# Altium schematic sheet 2_Microcontroller.SchDoc
size A4; SheetNumber: 2; SheetTotal: 4
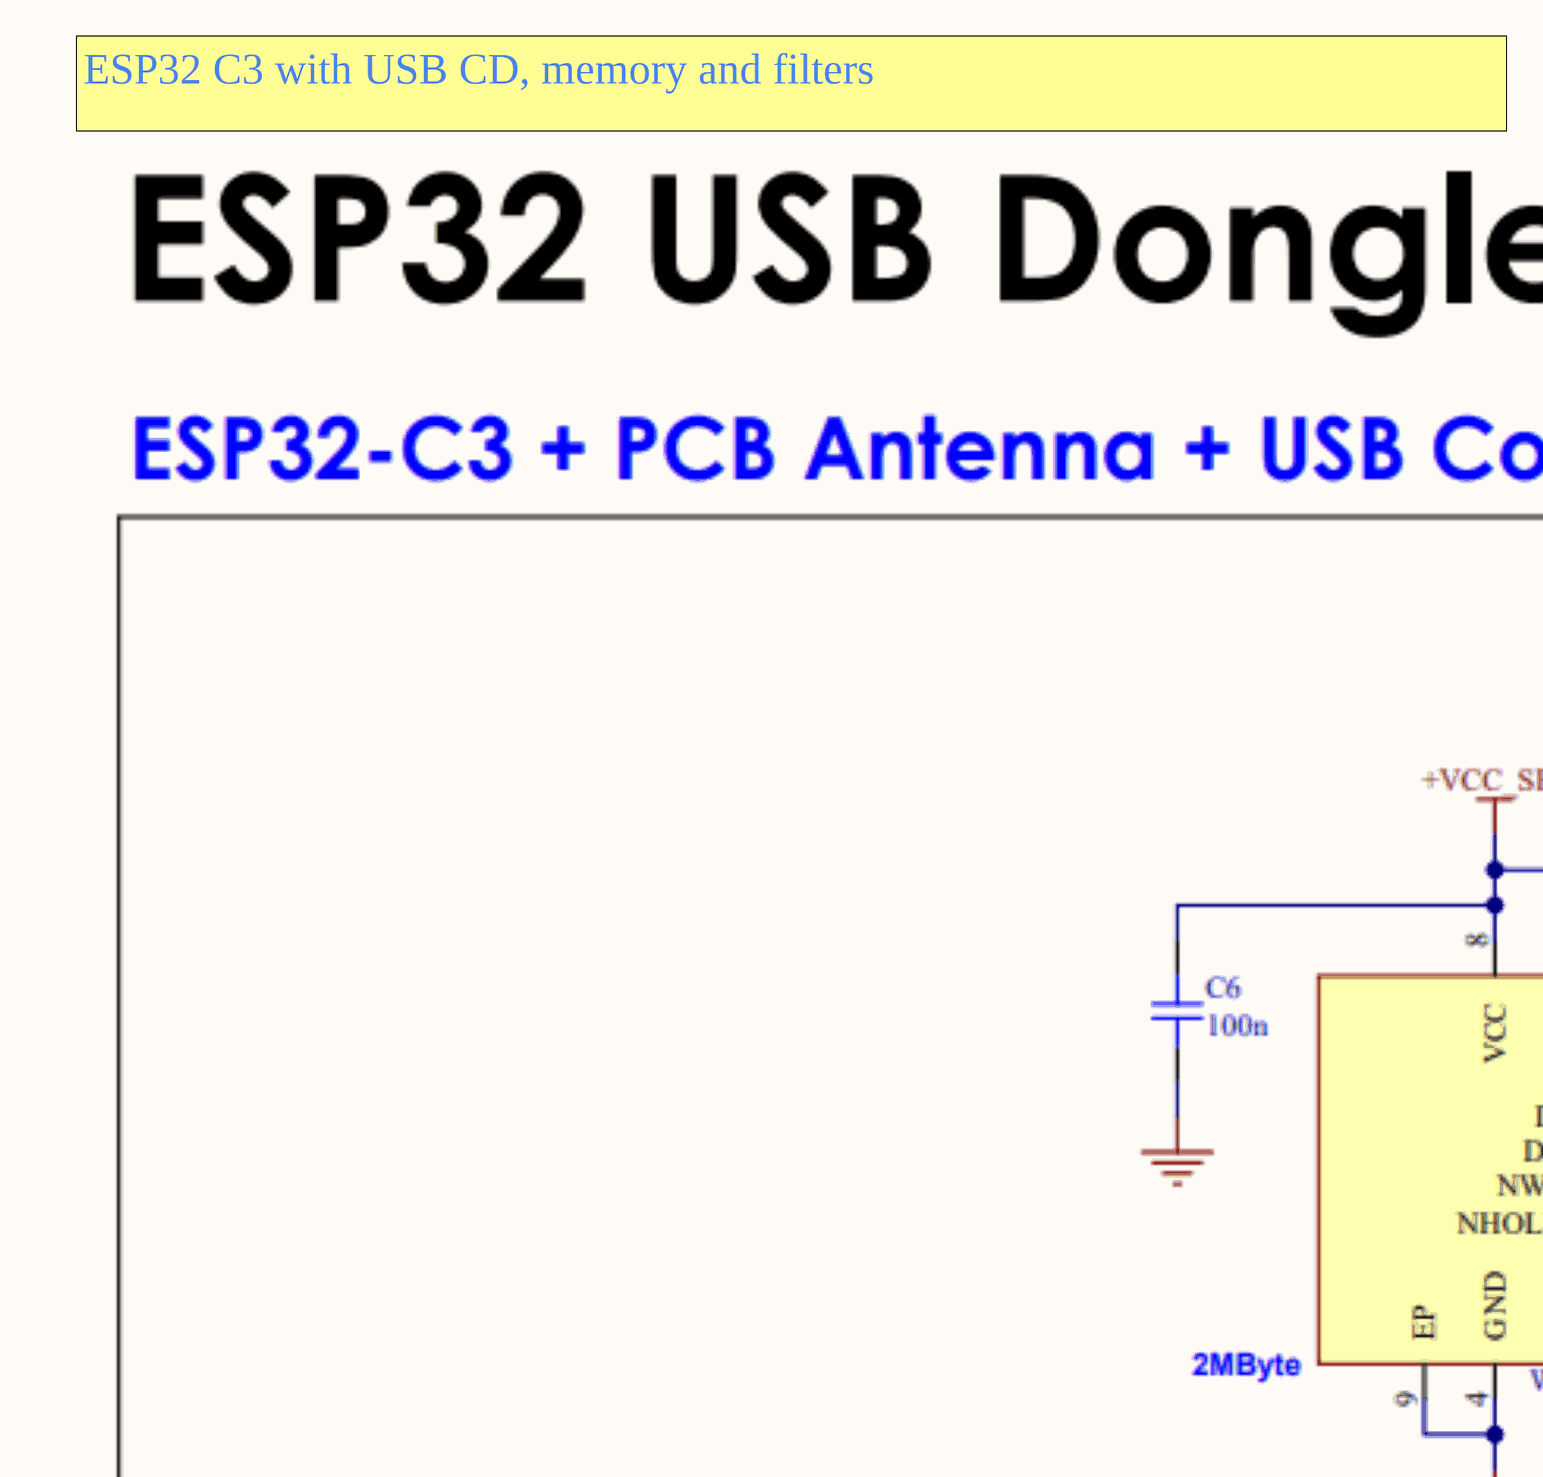
[diagram p0: 2_Microcontroller.SchDoc, top right]
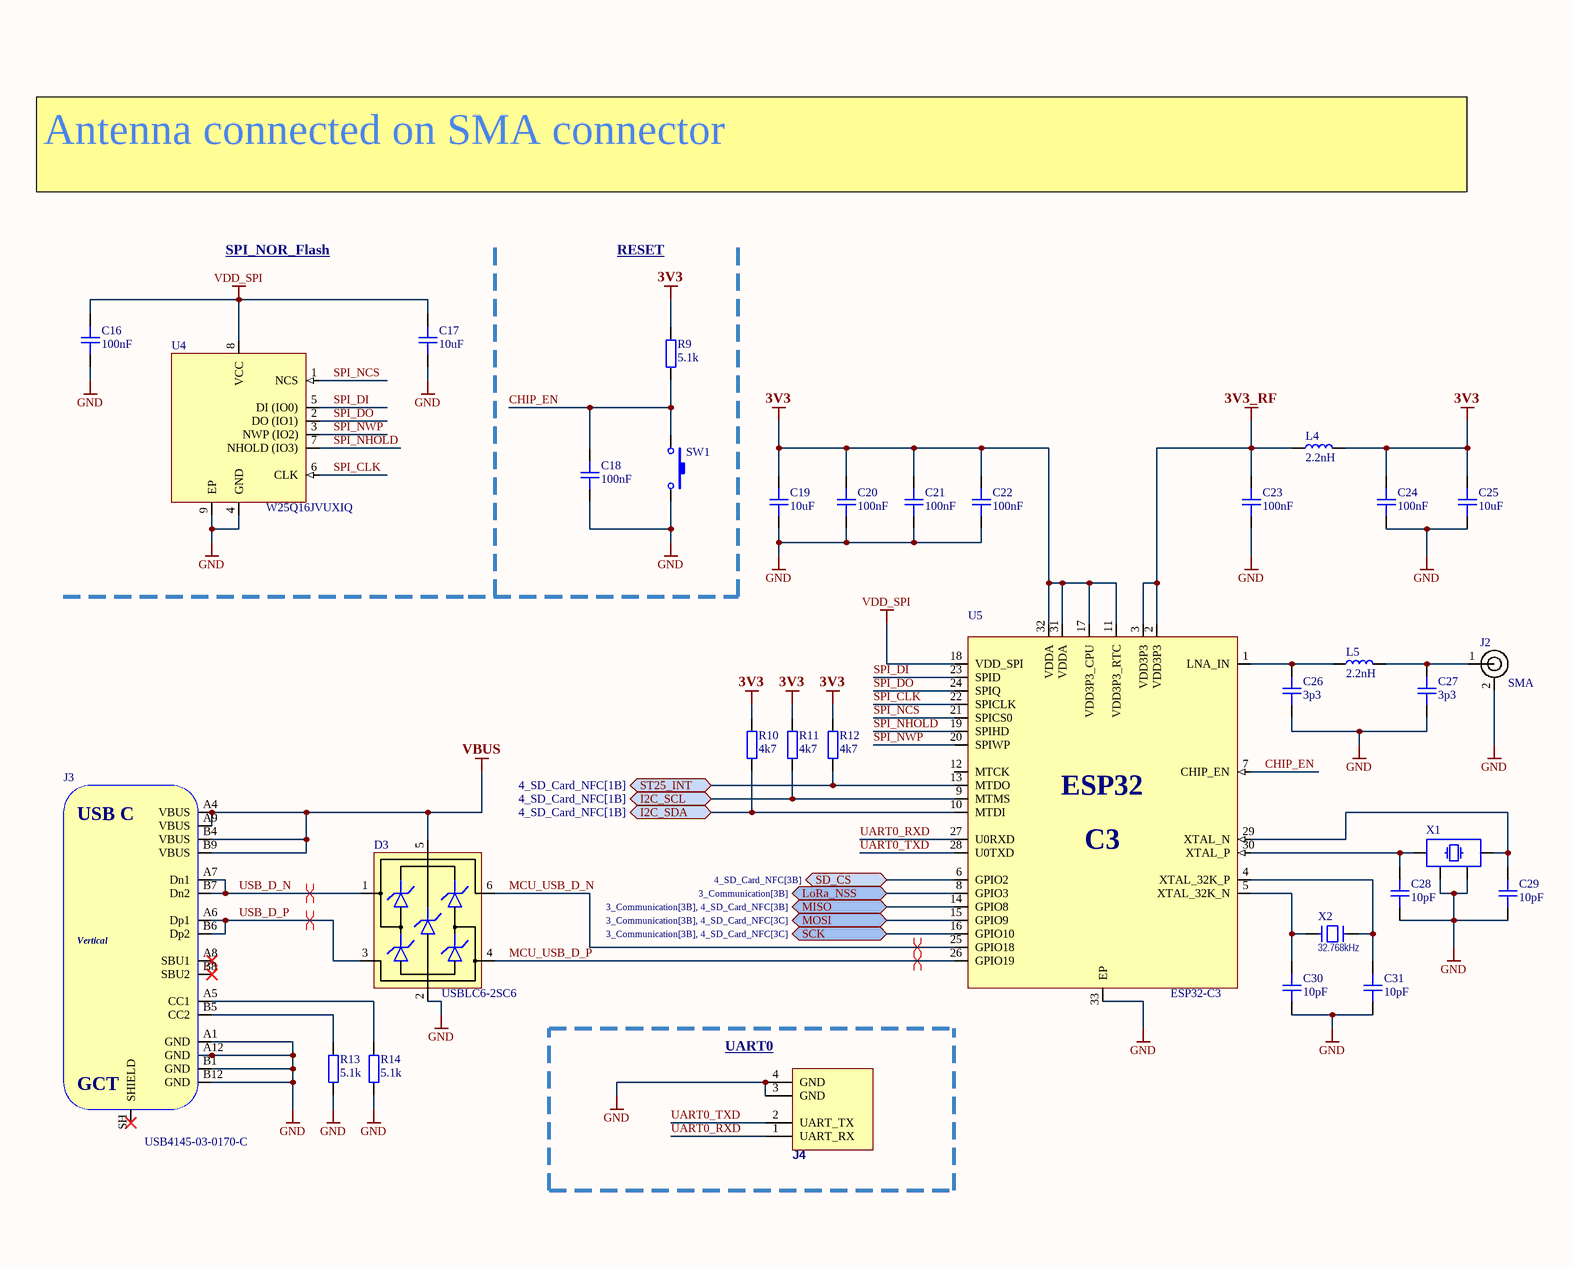
[diagram p1: 2_Microcontroller.SchDoc, bottom left]
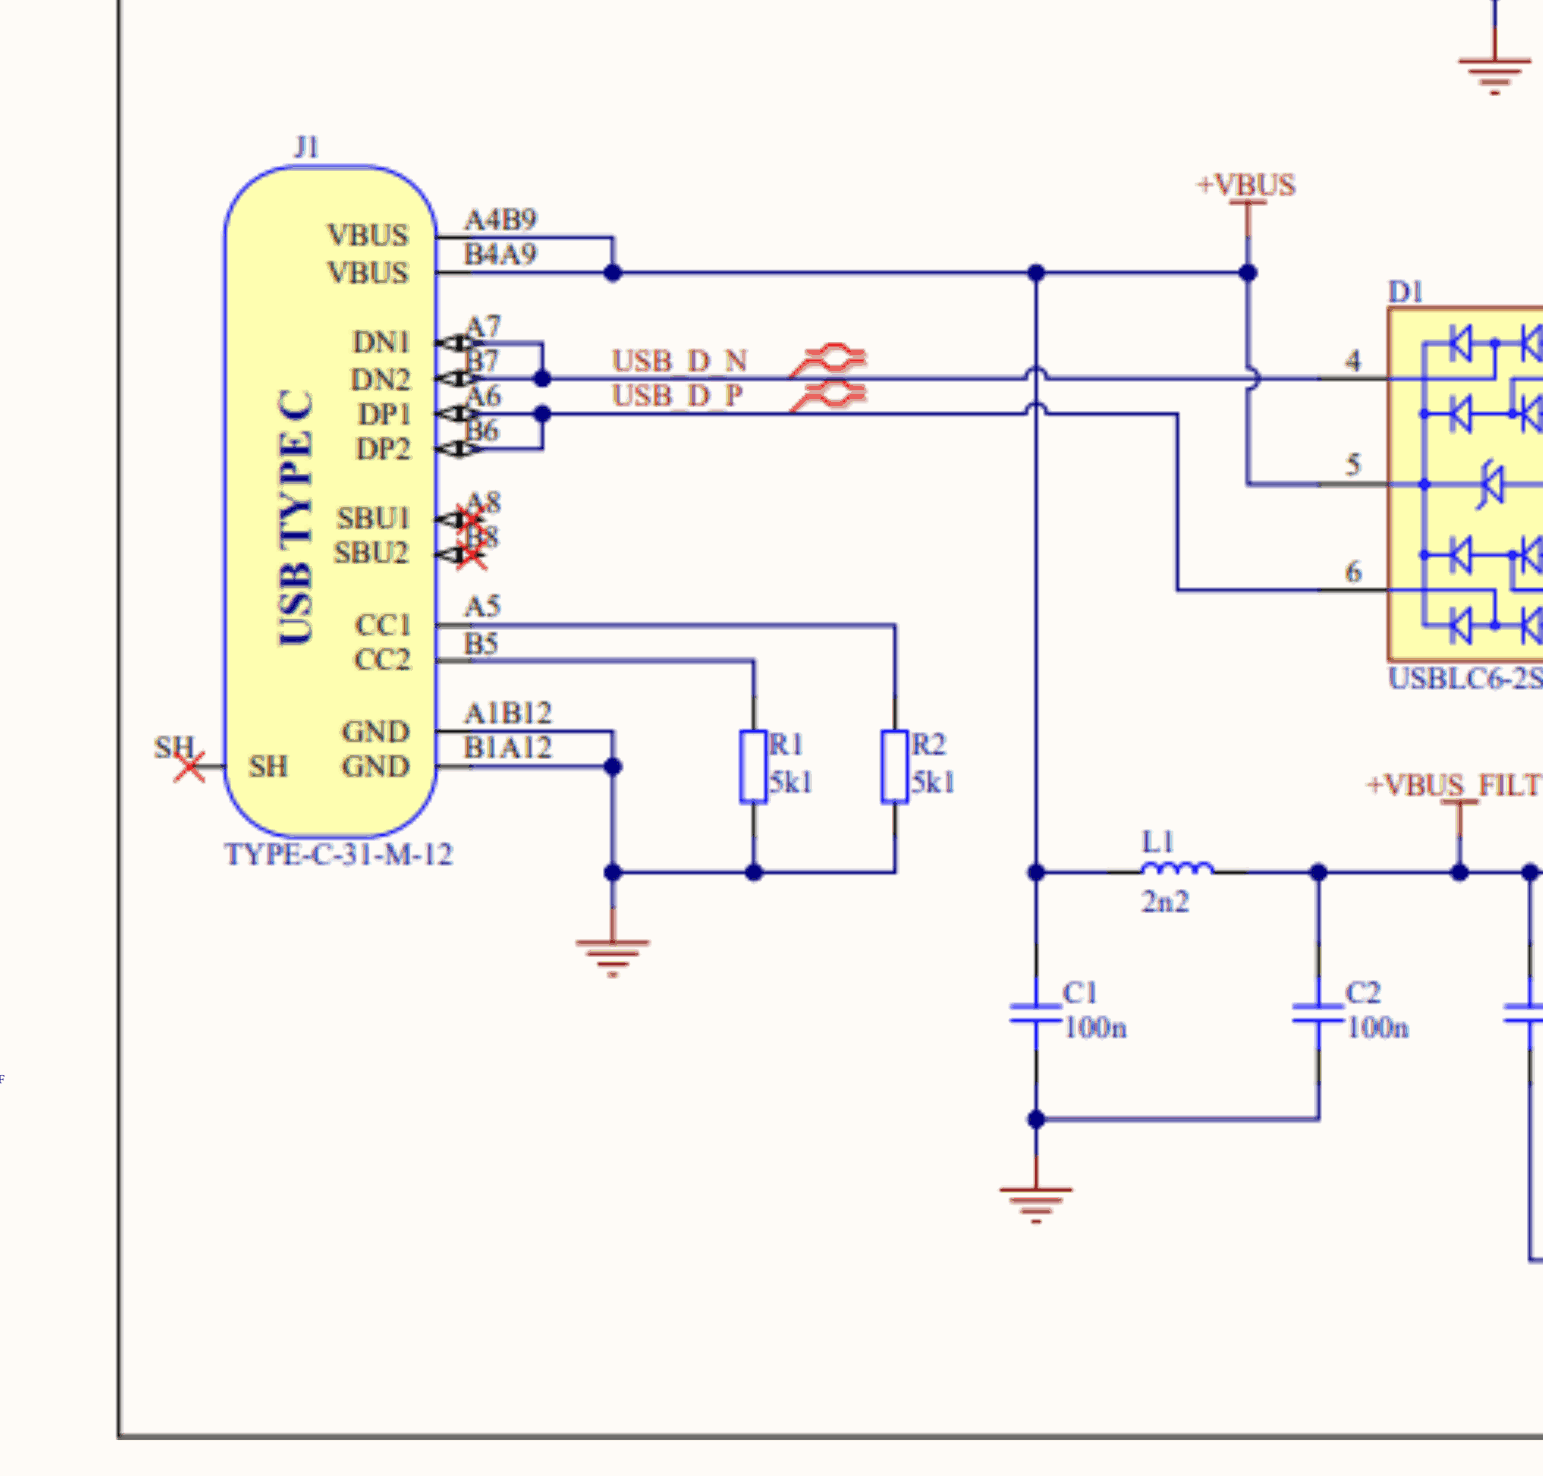
[diagram p2: 2_Microcontroller.SchDoc, bottom right]

## Parts
C16  100nF  [CAP_0603]
C17  10uF  [CAP_0805]
C18  100nF  [CAP_0603]
C19  10uF  [CAP_0805]
C20  100nF  [CAP_0603]
C21  100nF  [CAP_0603]
C22  100nF  [CAP_0603]
C23  100nF  [CAP_0603]
C24  100nF  [CAP_0603]
C25  10uF  [CAP_0805]
C26  3p3  [CAP_0603]
C27  3p3  [CAP_0603]
C28  10pF  [CAP_0603]
C29  10pF  [CAP_0603]
C30  10pF  [CAP_0603]
C31  10pF  [CAP_0603]
D3  USBLC6-2SC6  [SOT-23-6]
J2  SMA  [CON-SMA-EDGE-S]
J3  USB4145-03-0170-C  [USB4145-03-0170-C]
J4  Header1x4  (value not drawn)
L4  2.2nH  [IND_1008]
L5  2.2nH  [IND_1008]
R9  5.1k  [RES_0603]
R10  4k7  [RES_0603]
R11  4k7  [RES_0603]
R12  4k7  [RES_0603]
R13  5.1k  [RES_0603]
R14  5.1k  [RES_0603]
SW1  PTS645SM43SMTR92 LFS  [SW_PB]  (value not drawn)
U4  W25Q16JVUXIQ  [USON-8-2X3MM]
U5  ESP32-C3  [QFN32-5x5]
X1  XTAL_2016  [XTAL_2016]  (value not drawn)
X2  32.768kHz  [SX-3215]

## Blocks framed on the sheet
UART0: J4

## Ports
I2C_SCL (bidir, see 4_SD_Card_NFC[1B]), I2C_SDA (bidir, see 4_SD_Card_NFC[1B]), LoRa_NSS (bidir, see 3_Communication[3B]), MISO (bidir, see 3_Communication[3B], 4_SD_Card_NFC[3B]), MOSI (bidir, see 3_Communication[3B], 4_SD_Card_NFC[3C]), SCK (bidir, see 3_Communication[3B], 4_SD_Card_NFC[3C]), SD_CS (bidir, see 4_SD_Card_NFC[3B]), ST25_INT (bidir, see 4_SD_Card_NFC[1B])

## Nets
3V3: C19.2 C20.2 C21.2 C22.2 C24.2 C25.2 L4.2 R9.2 R10.1 R11.1 R12.1 U5.11(VDD3P3_RTC) U5.17(VDD3P3_CPU) U5.31(VDDA) U5.32(VDDA)
3V3_RF: C23.2 L4.1 U5.2(VDD3P3) U5.3(VDD3P3)
GND: C16.1 C17.1 C18.1 C19.1 C20.1 C21.1 C22.1 C23.1 C24.1 C25.1 C26.1 C27.1 C28.1 C29.1 C30.1 C31.1 D3.2(GND) J2.2 J3.A1(GND) J3.A12(GND) J3.B1(GND) J3.B12(GND) J4.3(GND) J4.4(GND) R13.1 R14.1 SW1.2 U4.4(GND) U4.9(EP) U5.33(EP) X1.2 X1.4
VBUS: D3.5(VBUS) J3.A4(VBUS) J3.A9(VBUS) J3.B4(VBUS) J3.B9(VBUS)
VDD_SPI: C16.2 C17.2 U4.8(VCC) U5.18(VDD_SPI)
CHIP_EN: C18.2 R9.1 SW1.1 U5.7(CHIP_EN)
I2C_SCL: R11.2 U5.9(MTMS) ; port I2C_SCL
I2C_SDA: R10.2 U5.10(MTDI) ; port I2C_SDA
LoRa_NSS: U5.8(GPIO3) ; port LoRa_NSS
MCU_USB_D_N: D3.6(IO1) U5.25(GPIO18)
MCU_USB_D_P: D3.4(IO2) U5.26(GPIO19)
MISO: U5.14(GPIO8) ; port MISO
MOSI: U5.15(GPIO9) ; port MOSI
SCK: U5.16(GPIO10) ; port SCK
SD_CS: U5.6(GPIO2) ; port SD_CS
SPI_CLK: U4.6(CLK) U5.22(SPICLK)
SPI_DI: U4.5(DI_(IO0)) U5.23(SPID)
SPI_DO: U4.2(DO_(IO1)) U5.24(SPIQ)
SPI_NCS: U4.1(NCS) U5.21(SPICS0)
SPI_NHOLD: U4.7(NHOLD_(IO3)) U5.19(SPIHD)
SPI_NWP: U4.3(NWP_(IO2)) U5.20(SPIWP)
ST25_INT: R12.2 U5.13(MTDO) ; port ST25_INT
UART0_RXD: J4.1(UART_RX) U5.27(U0RXD)
UART0_TXD: J4.2(UART_TX) U5.28(U0TXD)
USB_D_N: D3.1(IO1) J3.A7(Dn1) J3.B7(Dn2)
USB_D_P: D3.3(IO2) J3.A6(Dp1) J3.B6(Dp2)
NetC26_2: C26.2 L5.1 U5.1(LNA_IN)
NetC27_2: C27.2 J2.1 L5.2
NetC28_2: C28.2 U5.30(XTAL_P) X1.1
NetC29_2: C29.2 U5.29(XTAL_N) X1.3
NetC30_2: C30.2 U5.5(XTAL_32K_N) X2.2
NetC31_2: C31.2 U5.4(XTAL_32K_P) X2.1
NetJ3_A5: J3.A5(CC1) R14.2
NetJ3_B5: J3.B5(CC2) R13.2

Not connected (* = marked no-connect by the designer): J3 A8(SBU1)* B8(SBU2)* SH(SHIELD)*; U5 12(MTCK)

## Layout directives
differential pair: MCU_USB_D_N, MCU_USB_D_P, USB_D_N, USB_D_P

## Notes on the sheet
- ESP32 C3 with USB CD, memory and filters
- Antenna connected on SMA connector
- SPI_NOR_Flash
- RESET
- (in symbol ESP32-C3) ESP32; C3
- (in symbol USB4145-03-0170-C) USB C; Vertical

## Library data of the parts
C16 C18 C20-C24 C26-C31 = CAP_0603: Capacitor SMD 0603; Manufacturer: *; Manufacturer Part Number: *; Distributor Link: *; LCSC: *; Rating: *; Dielectric: *
C17 C19 C25 = CAP_0805: Capacitor SMD 0805; Manufacturer: *; Manufacturer Part Number: *; Distributor Link: *; LCSC: *; Rating: *; Dielectric: *
D3 = USBLC6-2SC6: Low-Capacitance ESD Protection USB; Manufacturer: STMicroelectronics; Manufacturer Part Number: USBLC6-2SC6; Distributor Link: https://www.mouser.de/ProductDetail/STMicroelectronics/USBLC6-2SC6?qs=po45yt2pPpu%2FhNIlwQdTlg%3D%3D
J2 = CON-SMA-EDGE-S: RF Connector SMA Female 50 Ohms 18 GHz PCB Edge Mount; Manufacturer: RF Solutions; Manufacturer Part Number: CON-SMA-EDGE-S
J3 = USB4145-03-0170-C: USB Connector Type C SMT 16 Pin Vertical; Manufacturer: GCT; Manufacturer Part Number: USB4145-03-0170-C
J4 = Header1x4: *; PackageReference: *; Manufacturer Part Number 1: *
L4 L5 = IND_1008: Inductor SMD 1008
R9-R14 = RES_0603: Resistor SMD 0603; Manufacturer: *; Manufacturer Part Number: *; Distributor Link: *; LCSC: *
SW1 = SW-PB: Switch; Published: 24-Mar-1999; LatestRevisionDate: 17-Jul-2002; LatestRevisionNote: Re-released for DXP Platform.; Publisher: Altium Limited; PackageDescription: Switch; 2 Leads; Manufacturer Part Number 1: PTS645SM43SMTR92 LFS; PackageReference: SW-PB
U4 = W25Q16JVUXIQ: 16M-BIT SERIAL FLASH MEMORY WITH DUAL/QUAD SPI USON-8; Manufacturer: Winbond; Manufacturer Part Number: W25Q16JVUXIQ; LCSC: C2843335
U5 = ESP32-C3: Ultra­Low­Power SoC with RISC­V Single­Core CPU Supporting IEEE 802.11b/g/n (2.4 GHz Wi­Fi) and Bluetooth® 5 (LE); Manufacturer: Espressif; Manufacturer Part Number: ESP32-C3; LCSC: C2838500
X1 = XTAL_2016: Crystal SMD 4-Pin 2.0x1.6mm; Distributor Link: *
X2 = CRYSTAL_1: Crystal; Manufacturer Part Number 1: *; PackageReference: SX-3215